# EasyEDA schematic Schematic_EasyCanad.json
TITLE: Sheet_1; REV: 1.0; Date: 2026-05-03; Sheet: 1/1; Drawn By: patricksta; Company: Your Company
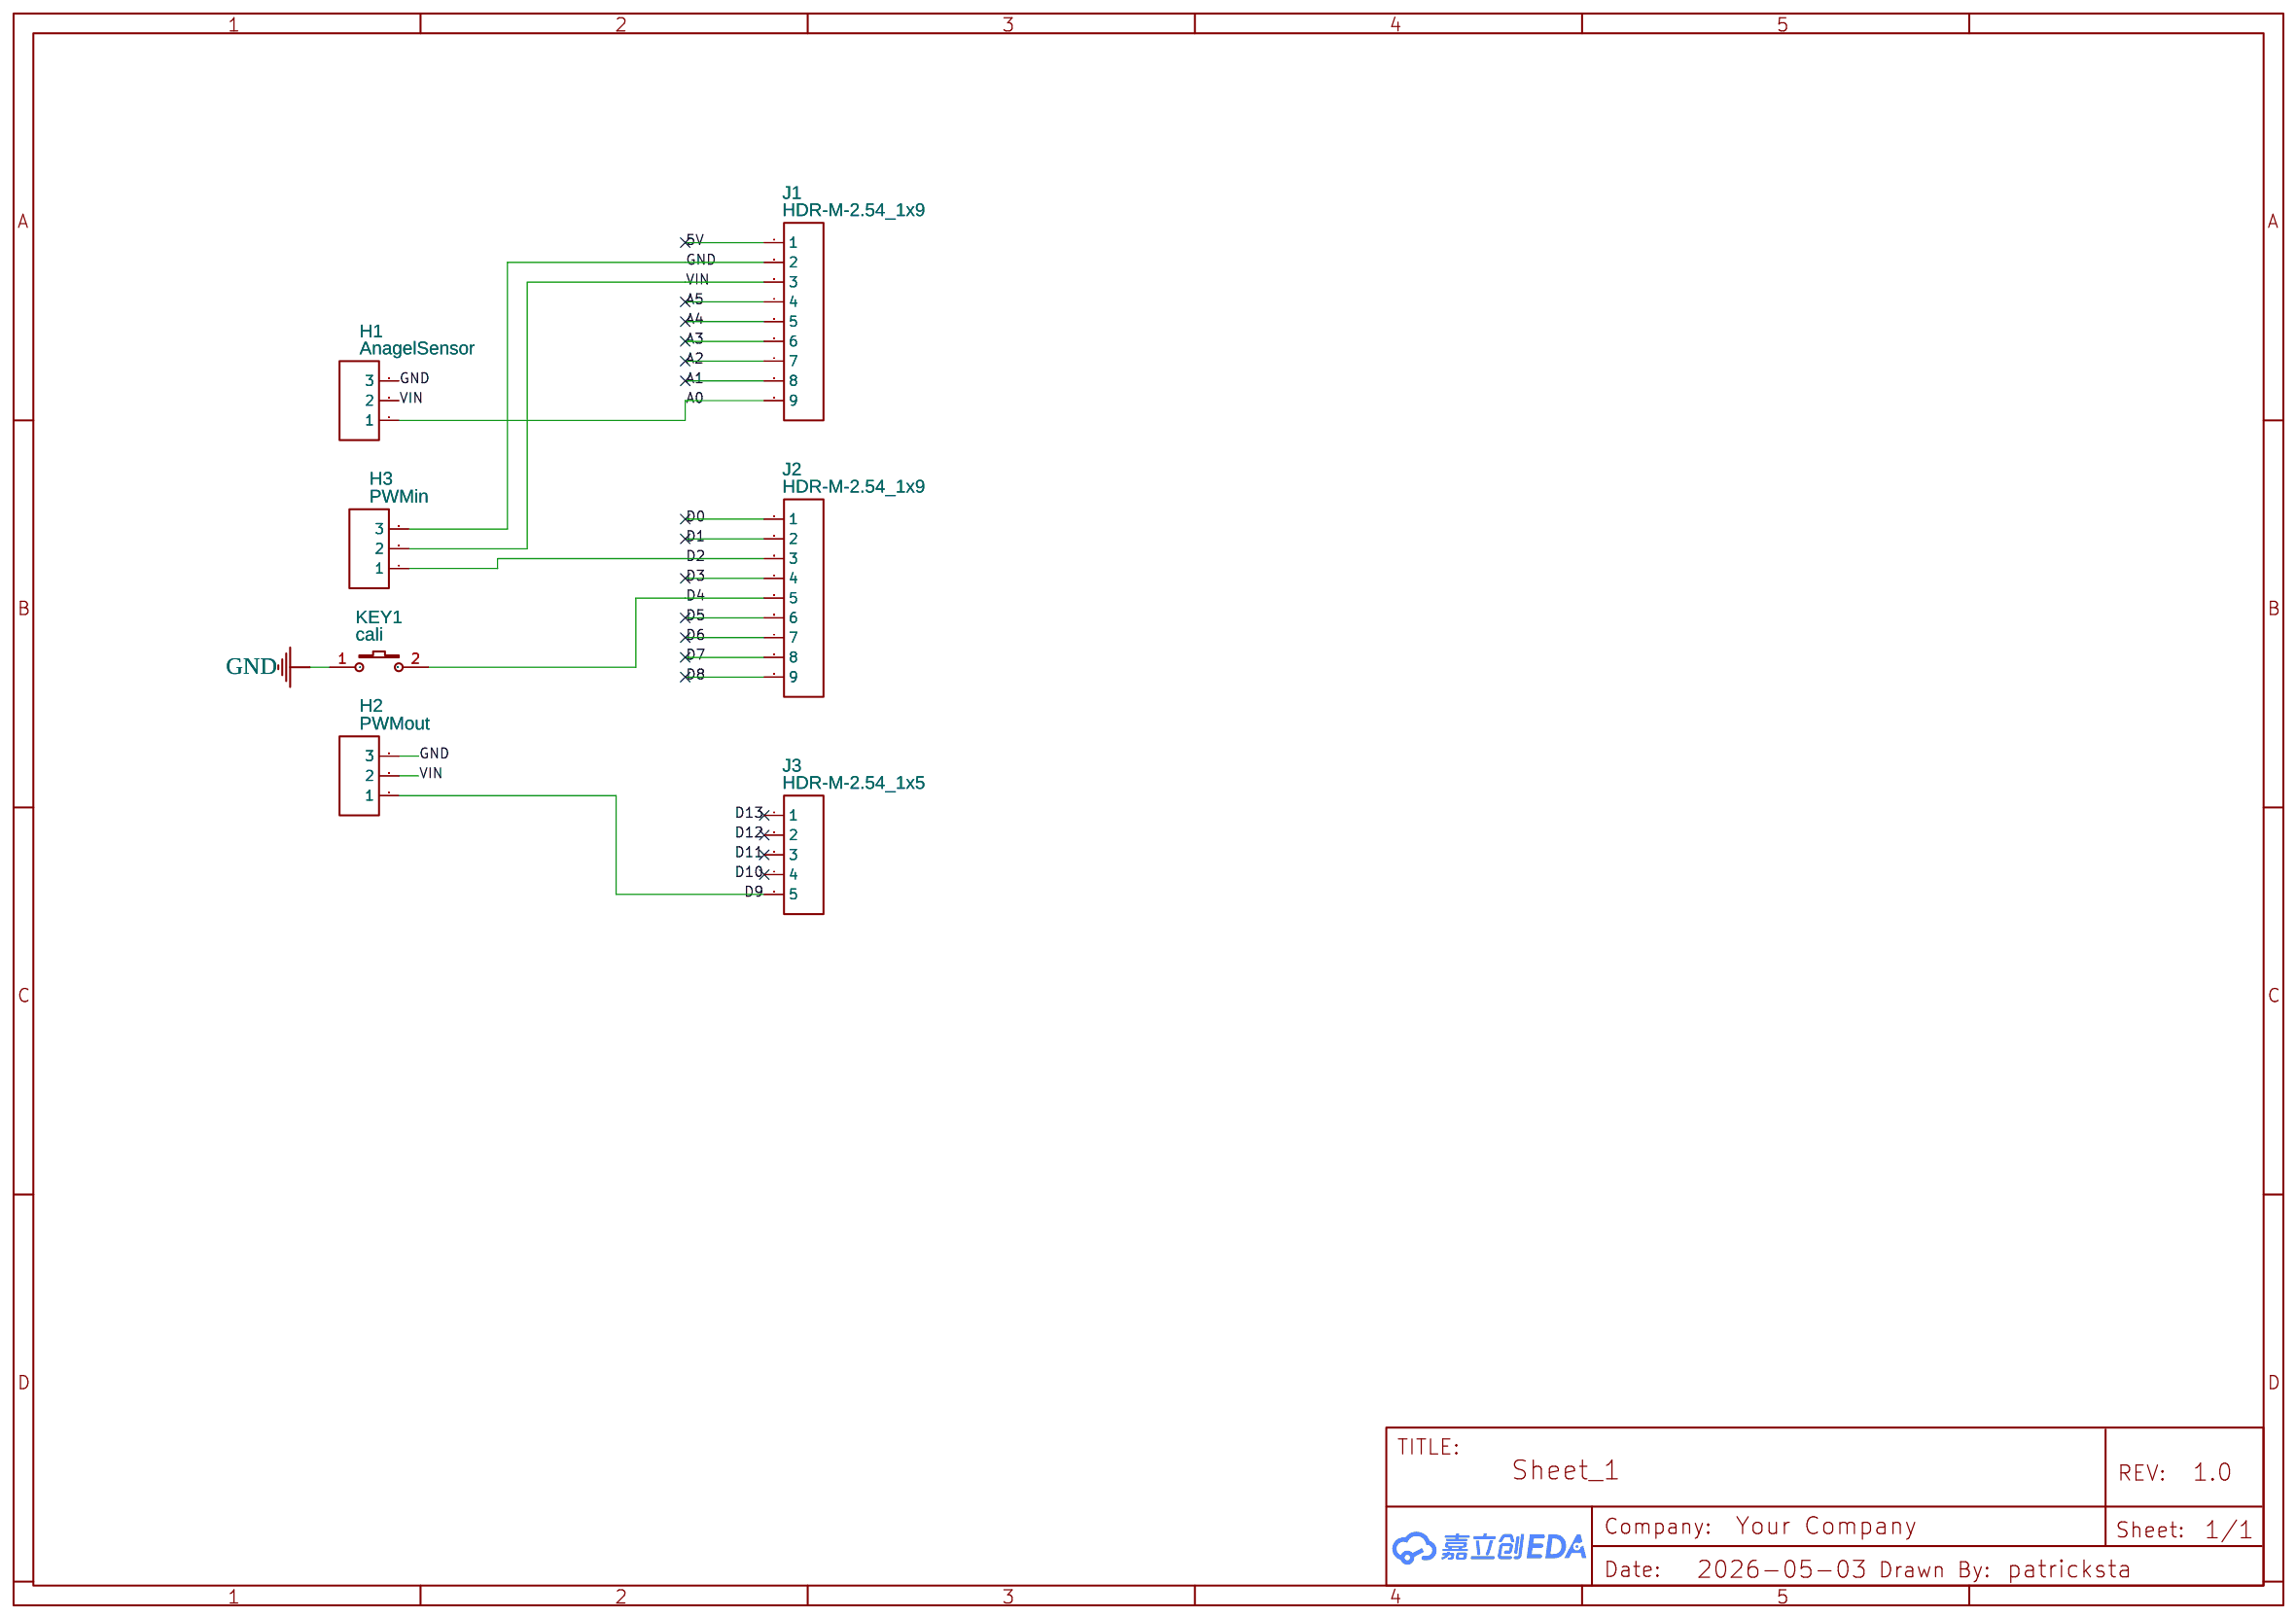
[diagram p0: schematic sheet]

## Parts
H1  AnagelSensor  [HDR-F-2.54_1X3]
H2  PWMout  [HDR-F-2.54_1X3]
H3  PWMin  [HDR-F-2.54_1X3]
J1  HDR-M-2.54_1x9  [HDR-M-2.54_1X9]
J2  HDR-M-2.54_1x9  [HDR-M-2.54_1X9]
J3  HDR-M-2.54_1x5  [HDR-M-2.54_1X5]
KEY1  cali  [KEY-SMD_2P-L6.2-W3.6-LS8.0]

## Library data of the parts
H1-H3 = HDR-F-2.54_1x3: Supplier Part: C146690; Supplier: LCSC; Contributor: LCEDA_Lib
J1 J2 = HDR-M-2.54_1x9: Supplier Part: C225484; Supplier: LCSC; Contributor: LCEDA_Lib
J3 = HDR-M-2.54_1x5: Supplier Part: C358687; Supplier: LCSC; Contributor: LCEDA_Lib
KEY1 = K2-3.6×6.1_SMD: Supplier Part: C118141; Supplier: LCSC; Manufacturer Part: K2-1107ST-A4SW-06; Contributor: LCEDA_Lib; 制造商: 韩国韩荣

## Nets
5V: J1.1
GND: H1.3 H2.3 H3.3 J1.2 KEY1.1
VIN: H1.2 H2.2 H3.2 J1.3
A0: H1.1 J1.9
A1: J1.8
A2: J1.7
A3: J1.6
A4: J1.5
A5: J1.4
D0: J2.1
D1: J2.2
D2: H3.1 J2.3
D3: J2.4
D4: J2.5 KEY1.2
D5: J2.6
D6: J2.7
D7: J2.8
D8: J2.9
D9: H2.1 J3.5
D10: J3.4
D11: J3.3
D12: J3.2
D13: J3.1
